# Altium project Stm8_PCB_Project_5.0.PrjPcb
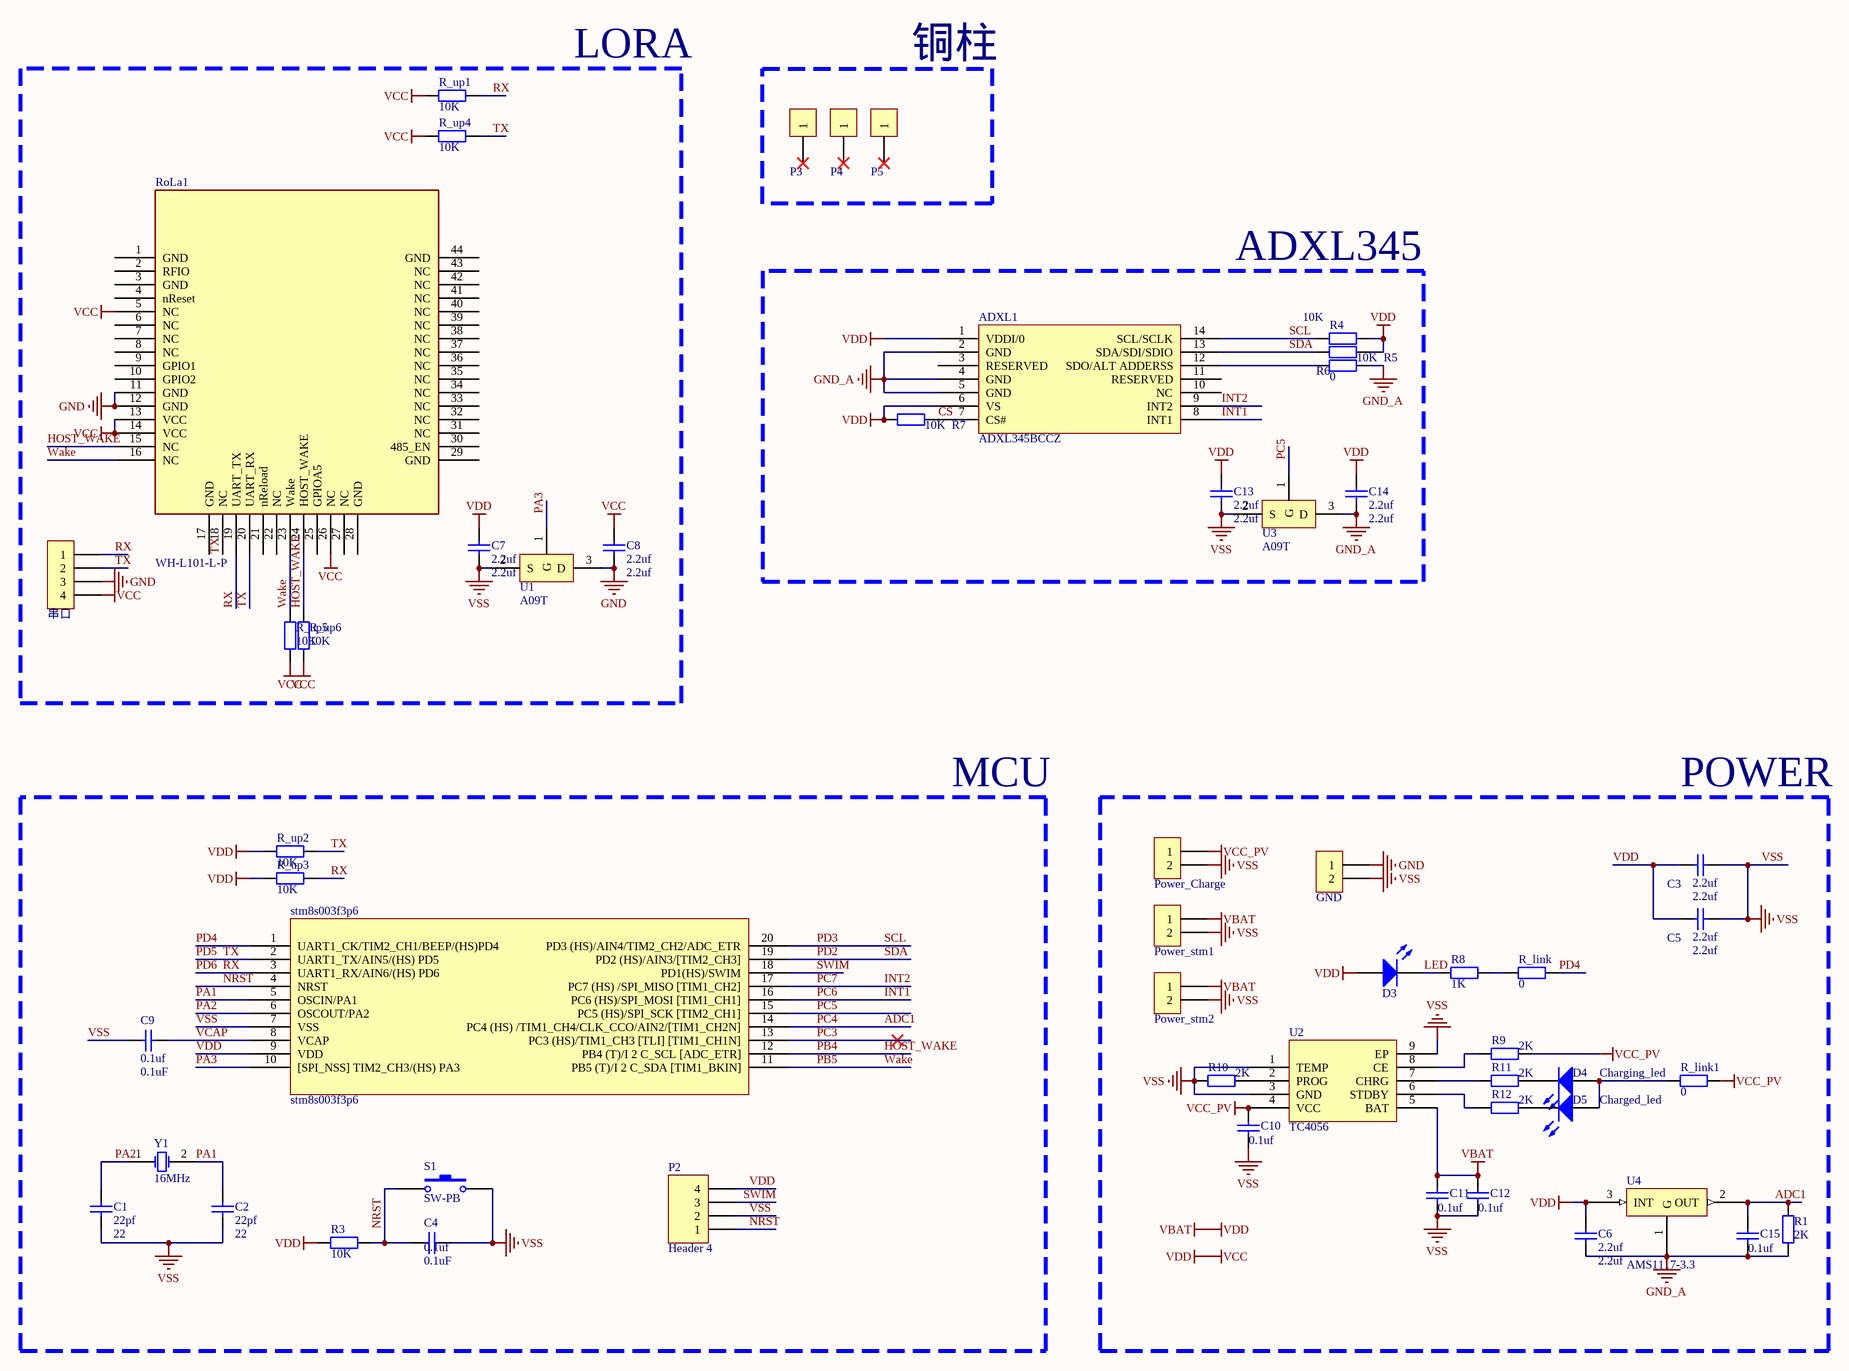
[diagram p0: Stm8_Sheet.SchDoc]
1 sheet, 55 parts. Net scope: global (net labels, ports and power ports of the same name join across sheets).
Board file: Stm8_PCB.PcbDoc

## Sheet Stm8_Sheet.SchDoc
size A2

### Parts
ADXL1  ADXL345BCCZ  [LGA-14_L5.0-W3.0-P0.80-BL - duplicate]
C1  22pf  value 22  [0603-C]
C2  22pf  value 22  [0603-C]
C3  2.2uf  [0603-C]
C4  0.1uf  [0603-C]
C5  2.2uf  [0603-C]
C6  2.2uf  [0603-C]
C7  2.2uf  [0603-C]
C8  2.2uf  [0603-C]
C9  0.1uf  [0603-C]
C10  value 0.1uf  [0603-C]  (hidden comment: 2.2uf)
C11  value 0.1uf  [0603-C]  (hidden comment: 2.2uf)
C12  value 0.1uf  [0603-C]  (hidden comment: 2.2uf)
C13  2.2uf  [0603-C]
C14  2.2uf  [0603-C]
C15  value 0.1uf  [0603-C]  (hidden comment: 2.2uf)
D3  LED0  [LED-BLUE-0805]  (value not drawn)
D4  LED0  [LED-BLUE-0805]  (value not drawn)
D5  LED0  [LED-BLUE-0805]  (value not drawn)
GND  XH接线座-2P  [HDR1X2]  (value not drawn)
P2  Header 4  [HDR1X4]
P3  铜柱孔  [铜柱孔]  (value not drawn)
P4  铜柱孔  [铜柱孔]  (value not drawn)
P5  铜柱孔  [铜柱孔]  (value not drawn)
Power_Charge  XH接线座-2P  [XH-2P]  (value not drawn)
Power_stm1  XH接线座-2P  [XH-2P]  (value not drawn)
Power_stm2  XH接线座-2P  [XH-2P]  (value not drawn)
R1  value 2K  [0603-R]  (hidden comment: 1K)
R3  10K  [0603-R]
R4  10K  [0603-R]
R5  10K  [0603-R]
R6  0  [0603-R]
R7  10K  [0603-R]
R8  1K  [0603-R]
R9  value 2K  [0603-R]  (hidden comment: 1K)
R10  value 2K  [0603-R]  (hidden comment: 1K)
R11  value 2K  [0603-R]  (hidden comment: 1K)
R12  value 2K  [0603-R]  (hidden comment: 1K)
R_link  value 0  [0402]  (hidden comment: 1K)
R_link1  value 0  [0402]  (hidden comment: 1K)
R_up1  10K  [0603-R]
R_up2  10K  [0603-R]
R_up3  10K  [0603-R]
R_up4  10K  [0603-R]
R_up5  10K  [0603-R]
R_up6  10K  [0603-R]
RoLa1  WH-L101-L-P  [WH-L101-L-P]
S1  SW-PB  [按键(贴片)]
stm8s003f3p6  stm8s003f3p6  [TSSOP20]
U1  A09T  [SOT23]
U2  TC4056  [SOP-8_L4.9-W3.9-P1.27-LS6.0-BL-EP]
U3  A09T  [SOT23]
U4  AMS1117-3.3  [SOT-223]
Y1  16MHz  [OSC-SMD_L5.0-W3.2 - duplicate]
串口  XH接线座-4P  [HDR1X4]  (value not drawn)

### Blocks framed on the sheet
LORA: C7 C8 R_up1 R_up4-R_up6 RoLa1 U1 串口
铜柱: P3-P5
ADXL345: ADXL1 C13 C14 R4-R7 U3
MCU: C1 C2 C4 C9 P2 R3 R_up2 R_up3 S1 stm8s003f3p6 Y1
POWER: C3 C5 C6 C10-C12 C15 D3-D5 GND Power_Charge Power_stm1 Power_stm2 R1 R8-R12 R_link R_link1 U2 U4

### Nets
GND: C8.2 GND.1 RoLa1.11(GND) RoLa1.12(GND) U1.3(D) 串口.3
GND_A: ADXL1.2(GND) ADXL1.4(GND) ADXL1.5(GND) C6.2 C14.2 C15.2 R1.2 R6.1 U3.3(D) U4.1(G)
VCC_PV: C10.1 Power_Charge.1 R9.1 R_link1.1 U2.4(VCC)
VDD: ADXL1.1(VDDI/0) ADXL1.6(VS) C3.2 C5.2 C6.1 C7.1 C8.1 C11.1 C12.1 C13.1 C14.1 D3.1(A) P2.4 Power_stm1.1 Power_stm2.1 R3.2 R4.1 R5.1 R7.2 R_up1.2 R_up2.2 R_up3.2 R_up4.2 R_up5.2 R_up6.2 RoLa1.5(NC) RoLa1.13(VCC) RoLa1.14(VCC) RoLa1.26(NC) stm8s003f3p6.9(VDD) U2.5(BAT) U4.3(INT) 串口.4  [also labelled VBAT, VCC]
VSS: C1.1 C2.1 C3.1 C4.1 C5.1 C7.2 C9.2 C10.2 C11.2 C12.2 C13.2 GND.2 P2.2 Power_Charge.2 Power_stm1.2 Power_stm2.2 R10.2 S1.2 stm8s003f3p6.7(VSS) U1.2(S) U2.1(TEMP) U2.3(GND) U2.9(EP) U3.2(S)
ADC1: C15.1 R1.1 stm8s003f3p6.14(PC4_(HS)_/TIM1_CH4/CLK_CCO/AIN2/[TIM1_CH2N]) U4.2(OUT)  [also labelled PC4]
CS: ADXL1.7(CS#) R7.1
HOST_WAKE: R_up6.1 RoLa1.15(NC) RoLa1.24(HOST_WAKE) stm8s003f3p6.12(PB4_(T)/I_2_C_SCL_[ADC_ETR])  [also labelled PB4]
INT1: ADXL1.8(INT1) stm8s003f3p6.16(PC6_(HS)/SPI_MOSI_[TIM1_CH1])  [also labelled PC6]
INT2: ADXL1.9(INT2) stm8s003f3p6.17(PC7_(HS)_/SPI_MISO_[TIM1_CH2])  [also labelled PC7]
LED: D3.2(K) R8.2
NRST: C4.2 P2.1 R3.1 S1.1 stm8s003f3p6.4(NRST)
PA1: C2.2 stm8s003f3p6.5(OSCIN/PA1) Y1.2(OSC2)
PA2: C1.2 stm8s003f3p6.6(OSCOUT/PA2) Y1.1(OSC1)
PA3: stm8s003f3p6.10([SPI_NSS]_TIM2_CH3/(HS)_PA3) U1.1(G)
PB5: R_up5.1 RoLa1.16(NC) RoLa1.23(Wake) stm8s003f3p6.11(PB5_(T)/I_2_C_SDA_[TIM1_BKIN])  [also labelled Wake]
PC3: stm8s003f3p6.13(PC3_(HS)/TIM1_CH3_[TLI]_[TIM1_CH1N])
PC5: stm8s003f3p6.15(PC5_(HS)/SPI_SCK_[TIM2_CH1]) U3.1(G)
PD2: ADXL1.13(SDA/SDI/SDIO) R5.2 stm8s003f3p6.19(PD2_(HS)/AIN3/[TIM2_CH3])  [also labelled SDA]
PD3: ADXL1.14(SCL/SCLK) R4.2 stm8s003f3p6.20(PD3_(HS)/AIN4/TIM2_CH2/ADC_ETR)  [also labelled SCL]
PD4: R_link.1 stm8s003f3p6.1(UART1_CK/TIM2_CH1/BEEP/(HS)PD4)
PD5: R_up2.1 R_up4.1 RoLa1.18(NC) RoLa1.20(UART_RX) stm8s003f3p6.2(UART1_TX/AIN5/(HS)_PD5) 串口.2  [also labelled TX]
PD6: R_up1.1 R_up3.1 RoLa1.19(UART_TX) stm8s003f3p6.3(UART1_RX/AIN6/(HS)_PD6) 串口.1  [also labelled RX]
SWIM: P2.3 stm8s003f3p6.18(PD1(HS)/SWIM)
VCAP: C9.1 stm8s003f3p6.8(VCAP)
NetADXL1_12: ADXL1.12(SDO/ALT_ADDERSS) R6.2
NetD4_1: D4.1(A) D5.1(A) R_link1.2
NetD4_2: D4.2(K) R11.1
NetD5_2: D5.2(K) R12.1
NetR8_1: R8.1 R_link.2
NetR9_2: R9.2 U2.8(CE)
NetR10_1: R10.1 U2.2(PROG)
NetR11_2: R11.2 U2.7(CHRG)
NetR12_2: R12.2 U2.6(STDBY)

Not connected (* = marked no-connect by the designer): ADXL1 3(RESERVED) 10(NC) 11(RESERVED); P3 1*; P4 1*; P5 1*; RoLa1 1(GND) 2(RFIO) 3(GND) 4(nReset) 6(NC) 7(NC) 8(NC) 9(GPIO1) 10(GPIO2) 17(GND) 21(nReload) 22(NC) 25(GPIOA5) 27(NC) 28(GND) 29(GND) 30(485_EN) 31(NC) 32(NC) 33(NC) 34(NC) 35(NC) 36(NC) 37(NC) 38(NC) 39(NC) 40(NC) 41(NC) 42(NC) 43(NC) 44(GND)

### Notes on the sheet
- (near R_link1) Charging_led
- Charged_led

### Library data of the parts
C1-C15 = Cap: Capacitor; Published: 8-Jun-2000; LatestRevisionDate: 17-Jul-2002; LatestRevisionNote: Re-released for DXP Platform.; PackageReference: RAD-0.3; Publisher: Altium Limited; PackageDescription: Radial Cap, Thru-Hole; 2 Leads; 0.3 in Pin Spacing
  C3 C5-C8 C13 C14: Value: 2.2uf
  C4 C9: Value: 0.1uF
D3-D5 = LED0: 发光二极管; Published: 8-Jun-2000; LatestRevisionDate: 08-Jul-2005; LatestRevisionNote: Mech Layer 1 removed.; PackageReference: LED-0; Publisher: Altium Limited
P2 = Header 4: Header, 4-Pin; LatestRevisionDate: 17-Jul-2002; LatestRevisionNote: Re-released for DXP Platform.; Publisher: Altium Limited
R1 R3-R12 R_link R_link1 R_up1-R_up6 = Res1: 贴片电阻; Published: 8-Jun-2000; LatestRevisionDate: 17-Jul-2002; LatestRevisionNote: Re-released for DXP Platform.; PackageReference: AXIAL-0.4; Publisher: Altium Limited
  R3-R5 R7 R_up1-R_up6: Value: 10K
  R6: Value: 0
  R8: Value: 1K
S1 = SW-PB: 微动开关; Published: 24-Mar-1999; LatestRevisionDate: 17-Jul-2002; LatestRevisionNote: Re-released for DXP Platform.; PackageReference: SPST-2; Publisher: Altium Limited
U2 = TC4056: TC4056电源模块
Y1 = XTAL_1: Crystal Oscillator; Published: 8-Jun-2000; LatestRevisionDate: 17-Jul-2002; LatestRevisionNote: Re-released for DXP Platform.; Publisher: Altium Limited